# Altium schematic sheet Transceivers.SchDoc
size 406 x 304 mm; SheetNumber: 7; SheetTotal: 10
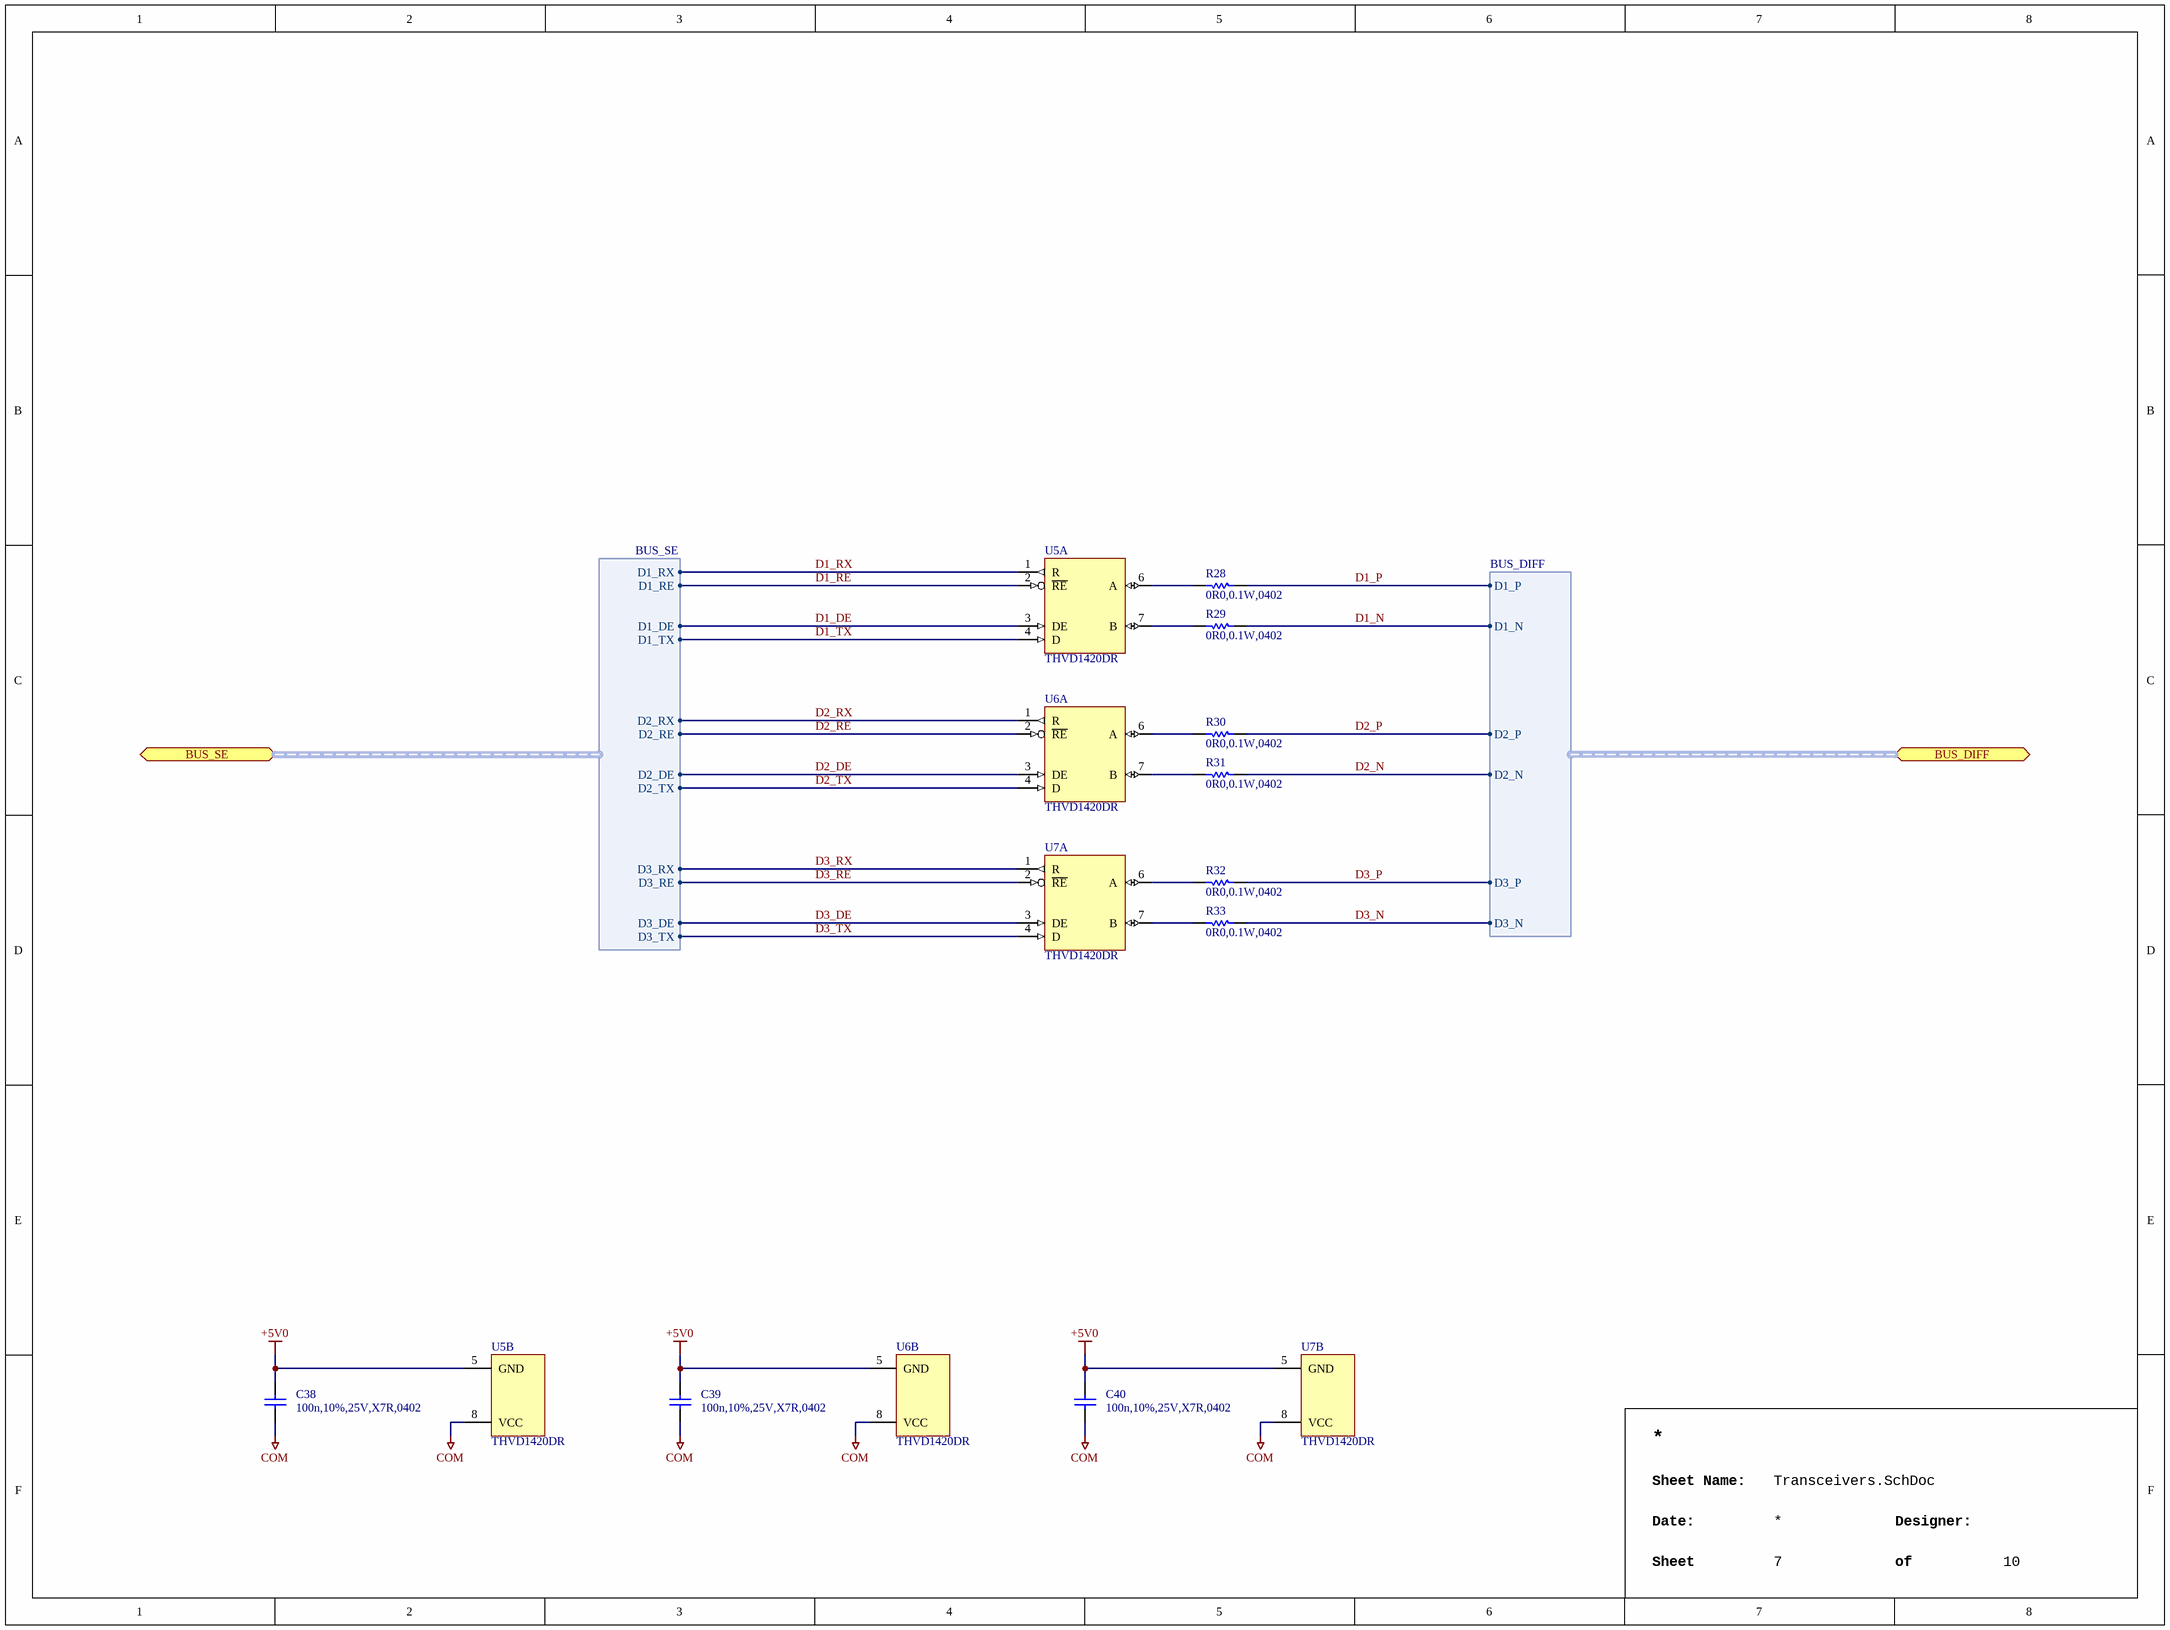
[diagram p0: Transceivers.SchDoc]

## Parts
C38  100n,10%,25V,X7R,0402  [CAPC1005X06N]
C39  100n,10%,25V,X7R,0402  [CAPC1005X06N]
C40  100n,10%,25V,X7R,0402  [CAPC1005X06N]
R28  0R0,0.1W,0402  [RESC1005X04N]
R29  0R0,0.1W,0402  [RESC1005X04N]
R30  0R0,0.1W,0402  [RESC1005X04N]
R31  0R0,0.1W,0402  [RESC1005X04N]
R32  0R0,0.1W,0402  [RESC1005X04N]
R33  0R0,0.1W,0402  [RESC1005X04N]
U5  THVD1420DR  [TEXASINSTRUMENTS_PKG_D0008A]  (parts A,B of 2)
U6  THVD1420DR  [TEXASINSTRUMENTS_PKG_D0008A]  (parts A,B of 2)
U7  THVD1420DR  [TEXASINSTRUMENTS_PKG_D0008A]  (parts A,B of 2)

## Ports
BUS_DIFF (bidir, harness BUS_DIFF), BUS_SE (bidir, harness BUS_SE)

## Harnesses
BUS_DIFF: D1_P, D1_N, D2_P, D2_N, D3_P, D3_N
BUS_SE: D1_RX, D1_DE, D1_RE, D1_TX, D3_RX, D3_DE, D3_RE, D3_TX, D2_RX, D2_DE, D2_RE, D2_TX

## Nets
+5V0: C38.2 C39.2 C40.2 U5.5(GND) U6.5(GND) U7.5(GND)
COM: C38.1 C39.1 C40.1 U5.8(VCC) U6.8(VCC) U7.8(VCC)
D1_DE: U5.3(DE) ; port BUS_SE.D1_DE
D1_N: R29.1 ; port BUS_DIFF.D1_N
D1_P: R28.1 ; port BUS_DIFF.D1_P
D1_RE: U5.2(~{RE}) ; port BUS_SE.D1_RE
D1_RX: U5.1(R) ; port BUS_SE.D1_RX
D1_TX: U5.4(D) ; port BUS_SE.D1_TX
D2_DE: U6.3(DE) ; port BUS_SE.D2_DE
D2_N: R31.1 ; port BUS_DIFF.D2_N
D2_P: R30.1 ; port BUS_DIFF.D2_P
D2_RE: U6.2(~{RE}) ; port BUS_SE.D2_RE
D2_RX: U6.1(R) ; port BUS_SE.D2_RX
D2_TX: U6.4(D) ; port BUS_SE.D2_TX
D3_DE: U7.3(DE) ; port BUS_SE.D3_DE
D3_N: R33.1 ; port BUS_DIFF.D3_N
D3_P: R32.1 ; port BUS_DIFF.D3_P
D3_RE: U7.2(~{RE}) ; port BUS_SE.D3_RE
D3_RX: U7.1(R) ; port BUS_SE.D3_RX
D3_TX: U7.4(D) ; port BUS_SE.D3_TX
NetR28_2: R28.2 U5.6(A)
NetR29_2: R29.2 U5.7(B)
NetR30_2: R30.2 U6.6(A)
NetR31_2: R31.2 U6.7(B)
NetR32_2: R32.2 U7.6(A)
NetR33_2: R33.2 U7.7(B)

## Notes on the sheet
- Sheet Name:
- Date:
- Sheet
- Designer:
- of

## Library data of the parts
C38-C40 = CAP,Cer,100nF,10%,25V,X7R,0402: 0.1ï¿½F ï¿½10% 25V Ceramic Capacitor X7R 0402 (1005 Metric); Manufacturer 1: Murata Electronics; Manufacturer 1 Part Number: GRM155R71E104KE14J; Vendor 1 Part Number: 490-14603-1-ND; Vendor 1: DigiKey; Value: 100nF; Part Name: CAP,Cer,100nF,10%,25V,X7R,0402; CreatedBy: Judd Foster; HelpURL: https://search.murata.co.jp/Ceramy/image/img/A01X/G101/ENG/GRM155R71E104KE14-01.pdf
R28-R33 = RES,0R0,0.1W,0402: 0 Ohms Jumper 0.1W, 1/10W Chip Resistor 0402 (1005 Metric) Automotive AEC-Q200 Thick Film; Manufacturer 1: Panasonic Electronic Components; Manufacturer 1 Part Number: ERJ-2GE0R00X; Vendor 1 Part Number: P0.0JCT-ND; Vendor 1: Digikey; Value: 0R; Part Name: RES,0R0,0.1W,0402; CreatedBy: Judd Foster; HelpURL: https://industrial.panasonic.com/cdbs/www-data/pdf/RDA0000/AOA0000C301.pdf
U5-U7 = THVD1420DR: 1/1 Transceiver Half RS422, RS485 8-SOIC; Manufacturer 1: Texas Instruments; Vendor 1 Part Number: 296-THVD1420DRCT-ND; Vendor 1: DigiKey; Part Name: THVD1420DR; CreatedBy: Judd Foster; HelpURL: https://www.ti.com/lit/ds/symlink/thvd1420.pdf?HQS=dis-dk-null-digikeymode-dsf-pf-null-wwe&ts=1735314435967; Manufacturer 1 Part Number: THVD1420DR